# EAGLE design block_base_M (EAGLE 9.6.2)
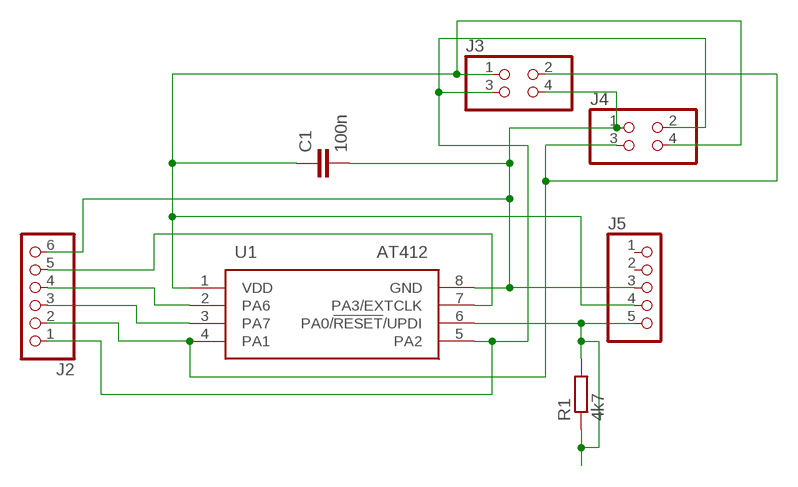
[diagram p0: schematic, sheet 1]

## Parts
C1  100n  C-EUC0603  [C0603]
J2  PINHD-1X6  [1X06]
J3  PINHD-2X2  [2X02]
J4  PINHD-2X2  [2X02]
J5  PINHD-1X5  [1X05]
R1  4k7  R-EU_R0603  [R0603]
U1  AT412  ATTINY412-SSN  [SOIC127P600X175-8N]

## Nets
GND: C1.2 J2.6 J3.4 J4.1 J5.3 U1.8(GND)
PA3: J2.5 U1.7(PA3/EXTCLK)
PA6: J2.4 U1.2(PA6)
PA7: J2.3 U1.3(PA7)
SCL: J2.1 J3.3 J4.2 U1.5(PA2)
SDA: J2.2 J3.2 J4.3 U1.4(PA1)
UPDI: J5.5 R1.1 R1.2 U1.6(PA0/!RESET!/UPDI)
VDD: C1.1 J3.1 J4.4 J5.4 U1.1(VDD)
Unconnected: J5.1 J5.2

## Library data of the parts
C1 = rcl:C-EU: CAPACITOR, European symbol; SPICEPREFIX: C
J2 = pinhead2:PINHD-1X6: PIN HEADER
J3 J4 = pinhead2:PINHD-2X2: PIN HEADER
J5 = pinhead2:PINHD-1X5: PIN HEADER
R1 = rcl:R-EU_: RESISTOR, European symbol; SPICEPREFIX: R
U1 = ATTINY412-SSN:ATTINY412-SSN: 8-bit Microcontrollers - MCU 20MHz, 4KB, SOIC8, Ind 105C, Green, Tube Source: Datasheet <http://www.microchip.com/mymicrochip/filehandler.aspx?ddocname=en599382>; DESCRIPTION: 8-bit Microcontrollers - MCU 20MHz, 4KB, SOIC8, Ind 105C, Green, Tube; HEIGHT: 1.75mm; MANUFACTURER_NAME: Microchip; MANUFACTURER_PART_NUMBER: ATTINY412-SSN; MOUSER_PART_NUMBER: 579-ATTINY412-SSN; MOUSER_PRICE-STOCK: https://www.mouser.co.uk/ProductDetail/Microchip-Technology/ATTINY412-SSN?qs=3HJ2avRr9PItQG9ZsCamPQ%3D%3D

## Board
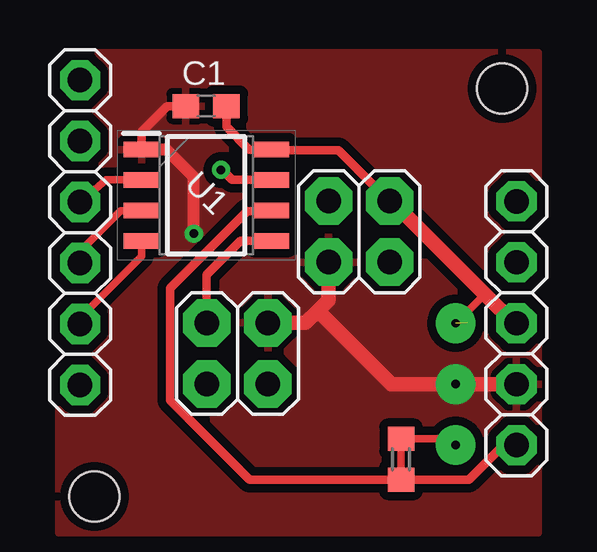
[diagram p1: board, top side]
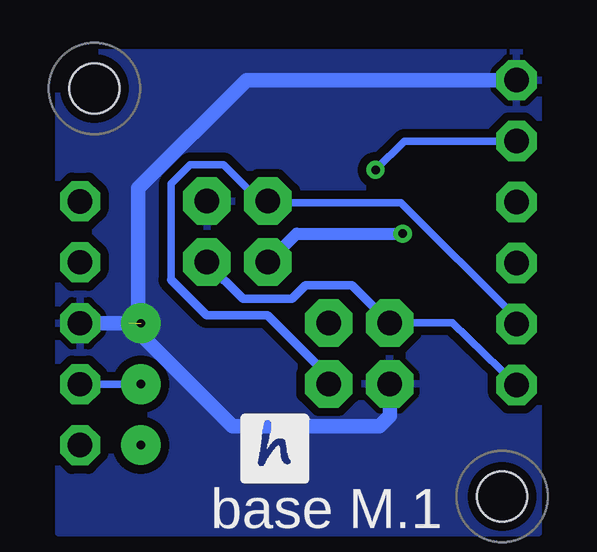
[diagram p2: board, bottom side, seen from below]

No outline drawn. Coordinates in mm, seen from the top.
Copper layers (1*16): Top 0.035mm / dielectric 1.5mm / Bottom 0.035mm
Design rules "default *": minimum track width 12mil, minimum drill 0.35mm, track to track 12mil, track to pad 12mil, pad to pad 12mil, via to via 12mil, smd to smd 12mil, copper to edge 15mil, drill to drill 40mil, minimum pad ring 10mil, minimum via ring 8mil, stop-mask expansion 4mil, vias tented up to drill 0mil, thermal gap 10mil
Holes 2.1 mm at 2,2 19,19

### Footprints (pad centres in the part's own frame; a part is rotated, then mirrored left to right if it is on the bottom)
C0603 = smd 1.1 x 1: 1 -0.85,0; 2 0.85,0
1X06 = drill 1.016 pad 1.676 octagon: 1 -6.35,0; 2 -3.81,0; 3 -1.27,0; 4 1.27,0; 5 3.81,0; 6 6.35,0
2X02 = drill 1.016 pad 1.981 octagon: 1 -1.27,-1.27; 2 -1.27,1.27; 3 1.27,-1.27; 4 1.27,1.27
1X05 = drill 1.016 pad 1.676 octagon: 1 -5.08,0; 2 -2.54,0; 3 0,0; 4 2.54,0; 5 5.08,0
R0603 = smd 1 x 1.1: 1 -0.85,0; 2 0.85,0
SOIC127P600X175-8N = smd 1.5 x 0.65: 1 -2.7,1.905; 2 -2.7,0.635; 3 -2.7,-0.635; 4 -2.7,-1.905; 5 2.7,-1.905; 6 2.7,-0.635; 7 2.7,0.635; 8 2.7,1.905

### Placement (x,y rotation side)
C1  6.65,18.26 0 top
J2  1.4,13 90 top
J3  13.04,13.04 0 top
J4  7.96,7.96 0 top
J5  19.6,9.22 270 top
R1  14.78,3.56 270 top
U1  6.66,14.55 0 top

### Tracks (layer width: path | path; a pad name or v marks a point on that pad's centre or on a via)
GND  (via drill 0.35 pad 1.65)  (2 unrouted)
  Top 0.305: v17.06,9.22 18.21,10.37 18.35,10.37
  Top 0.356: C1.2 7.5,17.4 8.45,16.46 U1.8 9.39,16.43 12.17,16.43 J3.4
  Top 0.61: J5.3 19.5,9.22 18.35,10.37 14.41,14.31 J3.4
  Bottom 0.61: 6.64,6.65 J4.1 6.68,5.36 7.11,4.94 13.24,4.94 17.54,9.24 | 17.27,9.22 17.17,9.32 17.17,14.84 12.66,19.35 J2.6 | v17.06,9.22 J5.3
  pour Bottom (isolate 0.356): 0.5,20.5 0.5,0.5 20.5,0.5 20.5,20.5
PA3  (via drill 0.35)
  Top 0.356: U1.7 7.75,15.19 7.3,15.63 v7.28,15.61
  Bottom 0.305: J2.5 6.08,16.81 v7.28,15.61
PA6
  Top 0.305: J2.4 2.48,15.19 U1.2
PA7
  Top 0.305: J2.3 1.4,12.21 3.1,13.91 3.62,13.91 3.63,13.92 U1.3
SCL
  Top 0.356: U1.5 8.09,12.65 6.68,11.24 J4.2
  Bottom 0.305: 6.6,9.25 J4.2 4.08,9.23 J2.1
  Bottom 0.356: J3.3 14.3,11.72 12.81,10.24 10.76,10.24 10.19,10.8 8.26,10.8 J4.2
SDA
  Top 0.305: J2.2 1.4,9.45 3.96,12.01 U1.4
  Bottom 0.305: 15.8,11.02 15.8,15.04 15.01,15.82 13.61,15.82 12.09,14.3 J3.2 11.71,14.25 6.21,14.25 1.4,9.44 J2.2
  Bottom 0.356: 15.8,11.02 14.33,9.55 11.78,9.55 9.22,7 J4.3
UPDI  (via drill 0.35 pad 1.65)
  Top 0.305: v17.06,4.14 16.79,4.41 R1.1 R1.2
  Top 0.356: U1.6 9.33,13.89 8.36,13.89 5.16,10.69 5.16,6.02 8.47,2.71 R1.2 17.61,2.71 19.04,4.14 J5.5
VDD  (via drill 0.35, 0.35 pad 1.65)
  Top 0.356: U1.1 3.96,17.2 5.03,18.26 C1.1
  Top 0.508: v6.15,12.95 6.12,12.98 6.12,15.34 5,16.46 U1.1
  Top 0.61: J3.1 11.76,10.19 11.32,9.74 | J4.4 10.8,9.23 11.32,9.74 | J5.4 14.38,6.68 11.32,9.74
  Bottom 0.305: J5.4 v17.06,6.68
  Bottom 0.508: J3.1 10.57,12.95 v6.15,12.95
  pour Top (isolate 0.356): 0.5,20.5 0.5,0.5 20.5,0.5 20.5,20.5

### Text on the board
bPlace: base M.1
bDocu: GND | P4 | VBAT | P0 | P1 | VUSB | SDA | GND | SCL | 3V3 | UPDI